# Altium schematic sheet ESP32-Controls.SchDoc
size A4; SheetNumber: 4; SheetTotal: 5
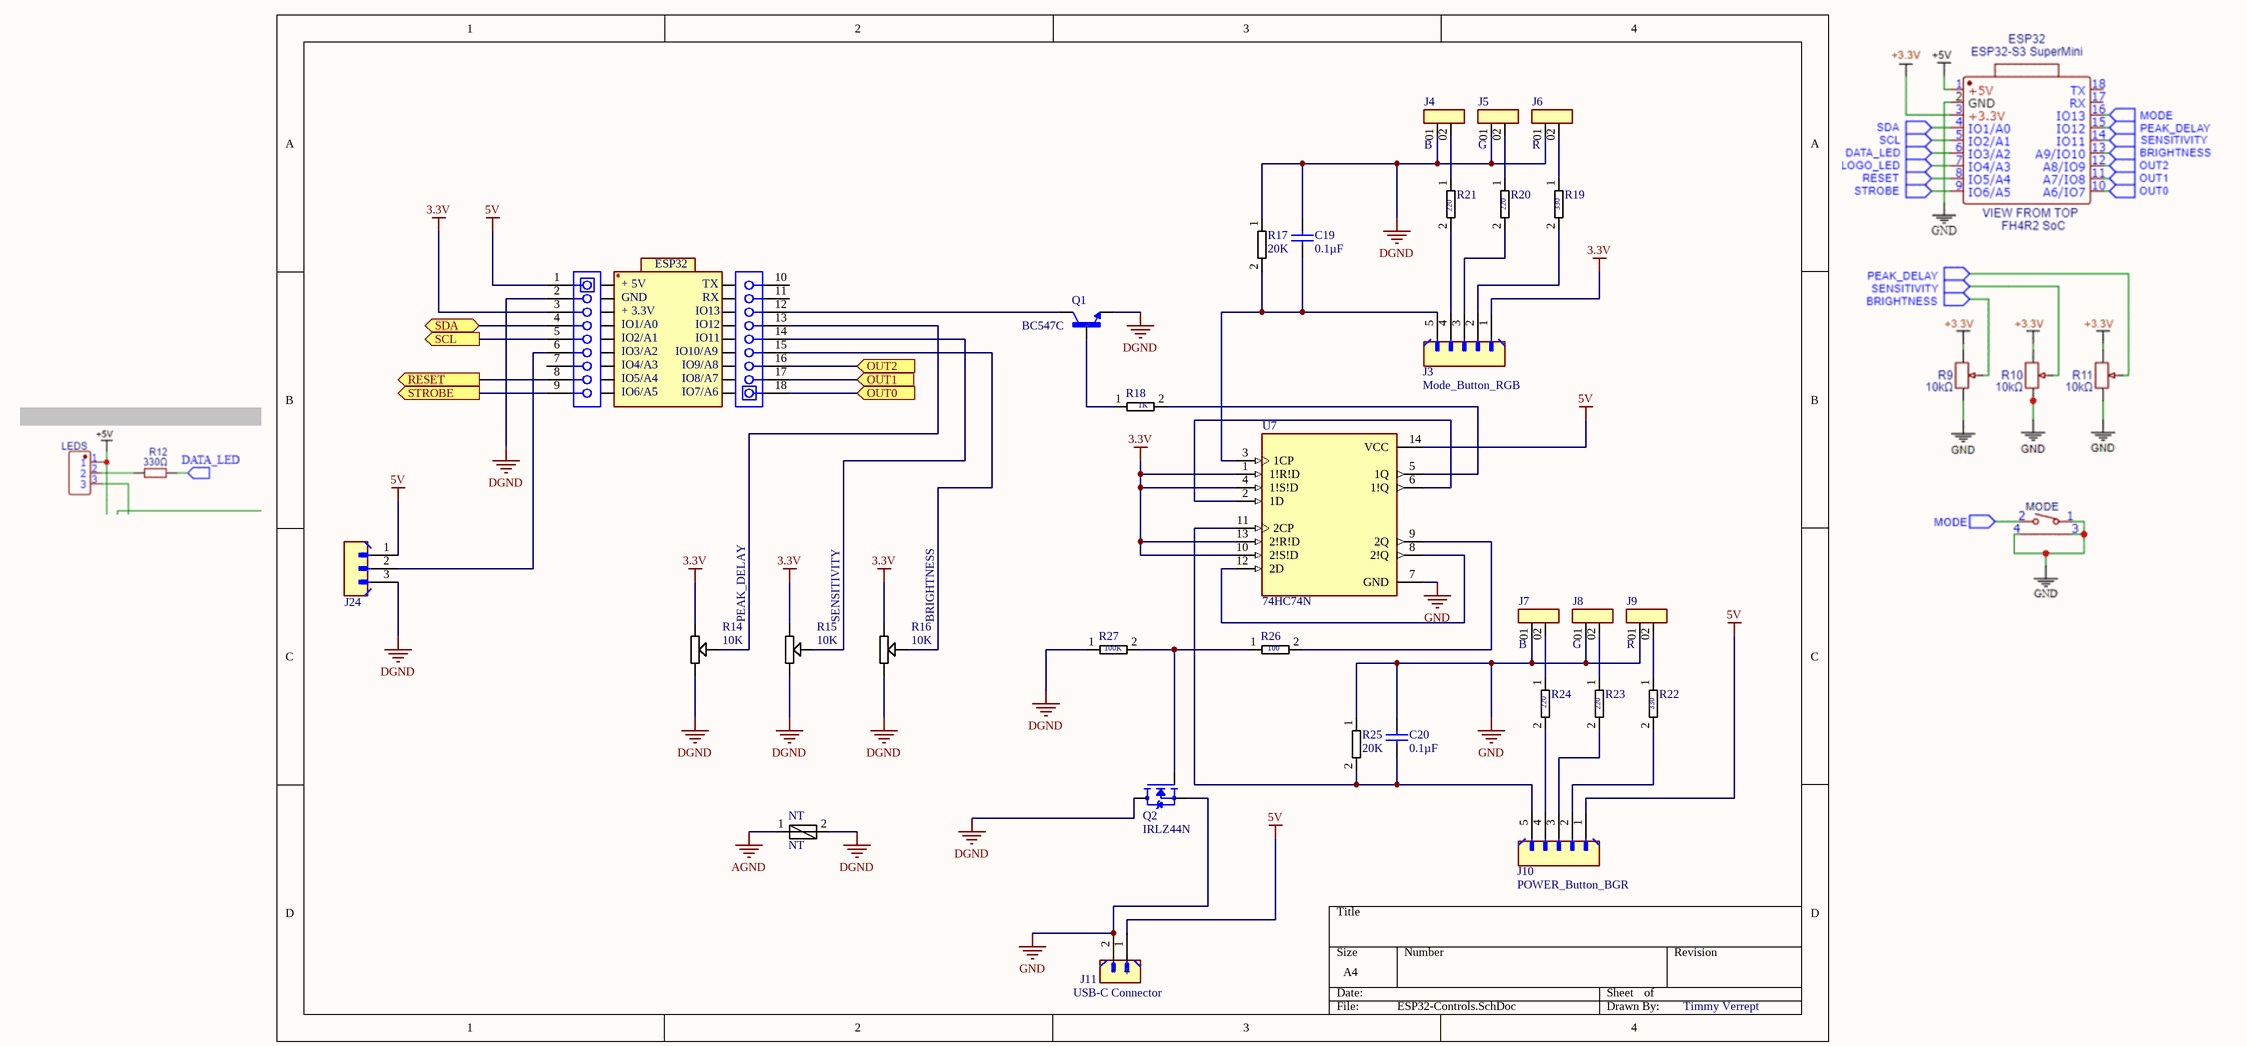
[diagram p0: ESP32-Controls.SchDoc]

## Parts
C19  0.1µF  [SMD_CAPACITOR]
C20  0.1µF  [SMD_CAPACITOR]
ESP32  ESP32_Placeholder  [ESP32_placeholder]  (value not drawn)
J3  Mode_Button_RGB  [Connector5P]
J4  B  [MaleHeader2P]
J5  G  [MaleHeader2P]
J6  R  [MaleHeader2P]
J7  B  [MaleHeader2P]
J8  G  [MaleHeader2P]
J9  R  [MaleHeader2P]
J10  POWER_Button_BGR  [Connector5P]
J11  USB-C Connector  [JST_B2B-PH-K-S]
J24  B3B-PH-K-S  [Connector3P]  (value not drawn)
NT  NT  [NT]
Q1  BC547C  [Transistor]
Q2  IRLZ44N  [MOSFET]
R14  10K  [POTENTIOMETER]
R15  10K  [POTENTIOMETER]
R16  10K  [POTENTIOMETER]
R17  20K  [SMD_RESISTOR]
R18  1K  [SMD_RESISTOR]
R19  330  [SMD_RESISTOR]
R20  220  [SMD_RESISTOR]
R21  220  [SMD_RESISTOR]
R22  330  [SMD_RESISTOR]
R23  220  [SMD_RESISTOR]
R24  220  [SMD_RESISTOR]
R25  20K  [SMD_RESISTOR]
R26  100  [SMD_RESISTOR]
R27  100K  [SMD_RESISTOR]
U7  74HC74N  [74HC74]

## Ports
OUT0 (in, see SpectrumAnalyzer[3A]), OUT1 (in, see SpectrumAnalyzer[3B]), OUT2 (in, see SpectrumAnalyzer[3C]), RESET (out, see SpectrumAnalyzer[2C]), SCL (out, see ClockGenerator[2C]), SDA (bidir, see ClockGenerator[2C]), STROBE (out, see SpectrumAnalyzer[2C])

## Nets
3.3V: ESP32.3 J3.1 R14.3 R15.3 R16.3 U7.1(1!R!D) U7.4(1!S!D) U7.10(2!S!D) U7.13(2!R!D)
5V: ESP32.1 J10.1 J11.1(+) J24.1 U7.14(VCC)
AGND: NT.1
DGND: C19.1 ESP32.2 J4.01 J5.01 J6.01 J24.3 NT.2 Q1.3(E) Q2.2(D) R14.1 R15.1 R16.1 R17.1 R27.1
GND: C20.1 J7.01 J8.01 J9.01 J11.2(-) Q2.3(S) R25.1 U7.7(GND)
OUT0: ESP32.18 ; port OUT0
OUT1: ESP32.17 ; port OUT1
OUT2: ESP32.16 ; port OUT2
RESET: ESP32.8 ; port RESET
SCL: ESP32.5 ; port SCL
SDA: ESP32.4 ; port SDA
STROBE: ESP32.9 ; port STROBE
NetC19_2: C19.2 J3.5 R17.2 U7.3(1CP)
NetC20_2: C20.2 J10.5 R25.2 U7.11(2CP)
NetESP32_6: ESP32.6 J24.2
NetESP32_12: ESP32.12 Q1.1(C)
NetESP32_13: ESP32.13 R14.2
NetESP32_14: ESP32.14 R15.2
NetESP32_15: ESP32.15 R16.2
NetJ3_2: J3.2 R19.2
NetJ3_3: J3.3 R20.2
NetJ3_4: J3.4 R21.2
NetJ4_02: J4.02 R21.1
NetJ5_02: J5.02 R20.1
NetJ6_02: J6.02 R19.1
NetJ7_02: J7.02 R24.1
NetJ8_02: J8.02 R23.1
NetJ9_02: J9.02 R22.1
NetJ10_2: J10.2 R22.2
NetJ10_3: J10.3 R23.2
NetJ10_4: J10.4 R24.2
NetQ1_2: Q1.2(B) R18.1
NetQ2_1: Q2.1(G) R26.1 R27.2
NetR18_2: R18.2 U7.5(1Q)
NetR26_2: R26.2 U7.9(2Q)
NetU7_2: U7.2(1D) U7.6(1!Q)
NetU7_8: U7.8(2!Q) U7.12(2D)

Not connected (* = marked no-connect by the designer): ESP32 7 10 11

## Notes on the sheet
- PEAK_DELAY
- SENSITIVITY
- (near R16) BRIGHTNESS
- Timmy Verrept
- (in symbol ESP32_Placeholder) + 5V; TX; GND; RX; + 3.3V; IO13; IO1/A0; IO12; IO2/A1; IO11; IO3/A2; IO10/A9; IO4/A3; IO9/A8; IO5/A4; IO8/A7; IO6/A5; IO7/A6

## Library data of the parts
C19 C20 = CER Capacitor: Manufacturer: Vitramon; Part Number: VJ0805Y682KXAMT
J3 J10 = Connector_5p: B5B-PH-K-S; MF: {'manufacturer': u'JST Sales America Inc.'}; Package: None; Price: None; Value: *; MP: B5B-PH-K-S; Availability: Unavailable
J4-J9 = Header_Male2p: Variable Height PCB Header Strips, 0.100 pitch; MF: SAMTEC; MP: MTSW-101-09-L-D-210; SnapEDA_Link: https://www.snapeda.com/parts/MTSW-101-09-L-D-210/Samtec/view-part/?ref=snap; Package: None; Value: *; Check_prices: https://www.snapeda.com/parts/MTSW-101-09-L-D-210/Samtec/view-part/?ref=eda
J11 = Connector_2p: Connector Header Through Hole 2 position 0.079 (2.00mm)B2B-PH-K-S; MF: JST Sales America Inc.; SnapEDA_Link: https://www.snapeda.com/parts/B2B-PH-K-S/JST/view-part/?ref=snap; Package: None; Value: *; MP: B2B-PH-K-S; Check_prices: https://www.snapeda.com/parts/B2B-PH-K-S/JST/view-part/?ref=eda
J24 = Connector_3p: MF: {'manufacturer': u'JST Sales America Inc.'}; Package: None; Price: None; Value: *; MP: B3B-PH-K-S; Availability: Unavailable
Q1 = BC547C: BJT, TO-92, 45V, 100mA, NPN, 0.5W, 150Â°C; MF: Diotec Semiconductor; Package: TO-92; Price: None; Value: *; SnapEDA_Link: https://www.snapeda.com/parts/BC547C/Diotec/view-part/?ref=snap; MP: BC547C; Availability: Unavailable; Check_prices: https://www.snapeda.com/parts/BC547C/Diotec/view-part/?ref=eda
Q2 = IRLZ44N: N-Channel 55 V 47A (Tc) 3.8W (Ta), 110W (Tc) Surface Mount D2PAK; MF: Infineon / IR; Package: TO-220-3 Infineon / IR; Availability: Not in stock; Value: *; MP: IRLZ44N; Check_prices: https://www.snapeda.com/parts/IRLZ44N/Infineon/view-part/?ref=eda; Price: None; SnapEDA_Link: https://www.snapeda.com/parts/IRLZ44N/Infineon/view-part/?ref=snap
R14-R16 = Potmeter: 16mm Rotary Potentiometers / WH148-1A-2-18T-L20; MF: Kls electronics; SnapEDA_Link: https://www.snapeda.com/parts/WH148-1A-2-18T-L20/Kls+electronics/view-part/?ref=snap; Package: Package; Value: *; MP: WH148-1A-2-18T-L20; Check_prices: https://www.snapeda.com/parts/WH148-1A-2-18T-L20/Kls+electronics/view-part/?ref=eda
R17-R27 = Resistor: RES SMD 681 OHM 0.1% 1/8W 0805; Manufacturer: Yageo; Manufacturer Part Number: RT0805BRD07681RL; Value: 681Ω; Temperature Coefficient: 25 ppm/°C; Power Rating: 0.125W; Voltage Rating: 150V; Tolerance: 0.0025; ComponentLink2URL: http://www.yageo.com/documents/recent/PYu-RT_1-to-0.01_RoHS_L_9.pdf; Ipc Land Pattern Name: RESC200125X50; Footprint Url: http://www.yageo.com/exep/pages/download/literatures/PYu-R_Mount_10.pdf; Temperature: -55°C to +155°C; Resistance: 681Ω; Mouser Description: Thin Film Resistors - SMD 1/8W 681 ohm .1% 25ppm; Temperature Range High: +155°C; Device Class L3: Chip SMD Resistors; Automotive: No; Octopart: https://octopart.com/rt0805brd07681rl-yageo-1270194; Device Class L1: Passive Components; Package: RT0805; Device Class L2: Resistors; Category: Res; RoHS: TRUE; Composition: Thin Film; ComponentLink2Description: Datasheet; Temperature Range Low: -55°C; Lead Free: Yes; Digikey Description: RES SMD 681 OHM 0.1% 1/8W 0805; Height: 0.6mm; Series: RT
U7 = 74HC74N,652: D FLIP-FLOP; MF: Rochester Electronics, LLC; Check_prices: https://www.snapeda.com/parts/74HC74N,652/Rochester%20Electronics/view-part/5010421/?ref=eda; Price: None; SnapEDA_Link: https://www.snapeda.com/parts/74HC74N,652/Rochester%20Electronics/view-part/5010421/?ref=snap; MP: 74HC74N,652; Value: *; Availability: Warning; Package: None; Purchase-URL: https://pricing.snapeda.com/search/part/74HC74N,652/?ref=eda